# Altium project antenna_connection.PrjPcb
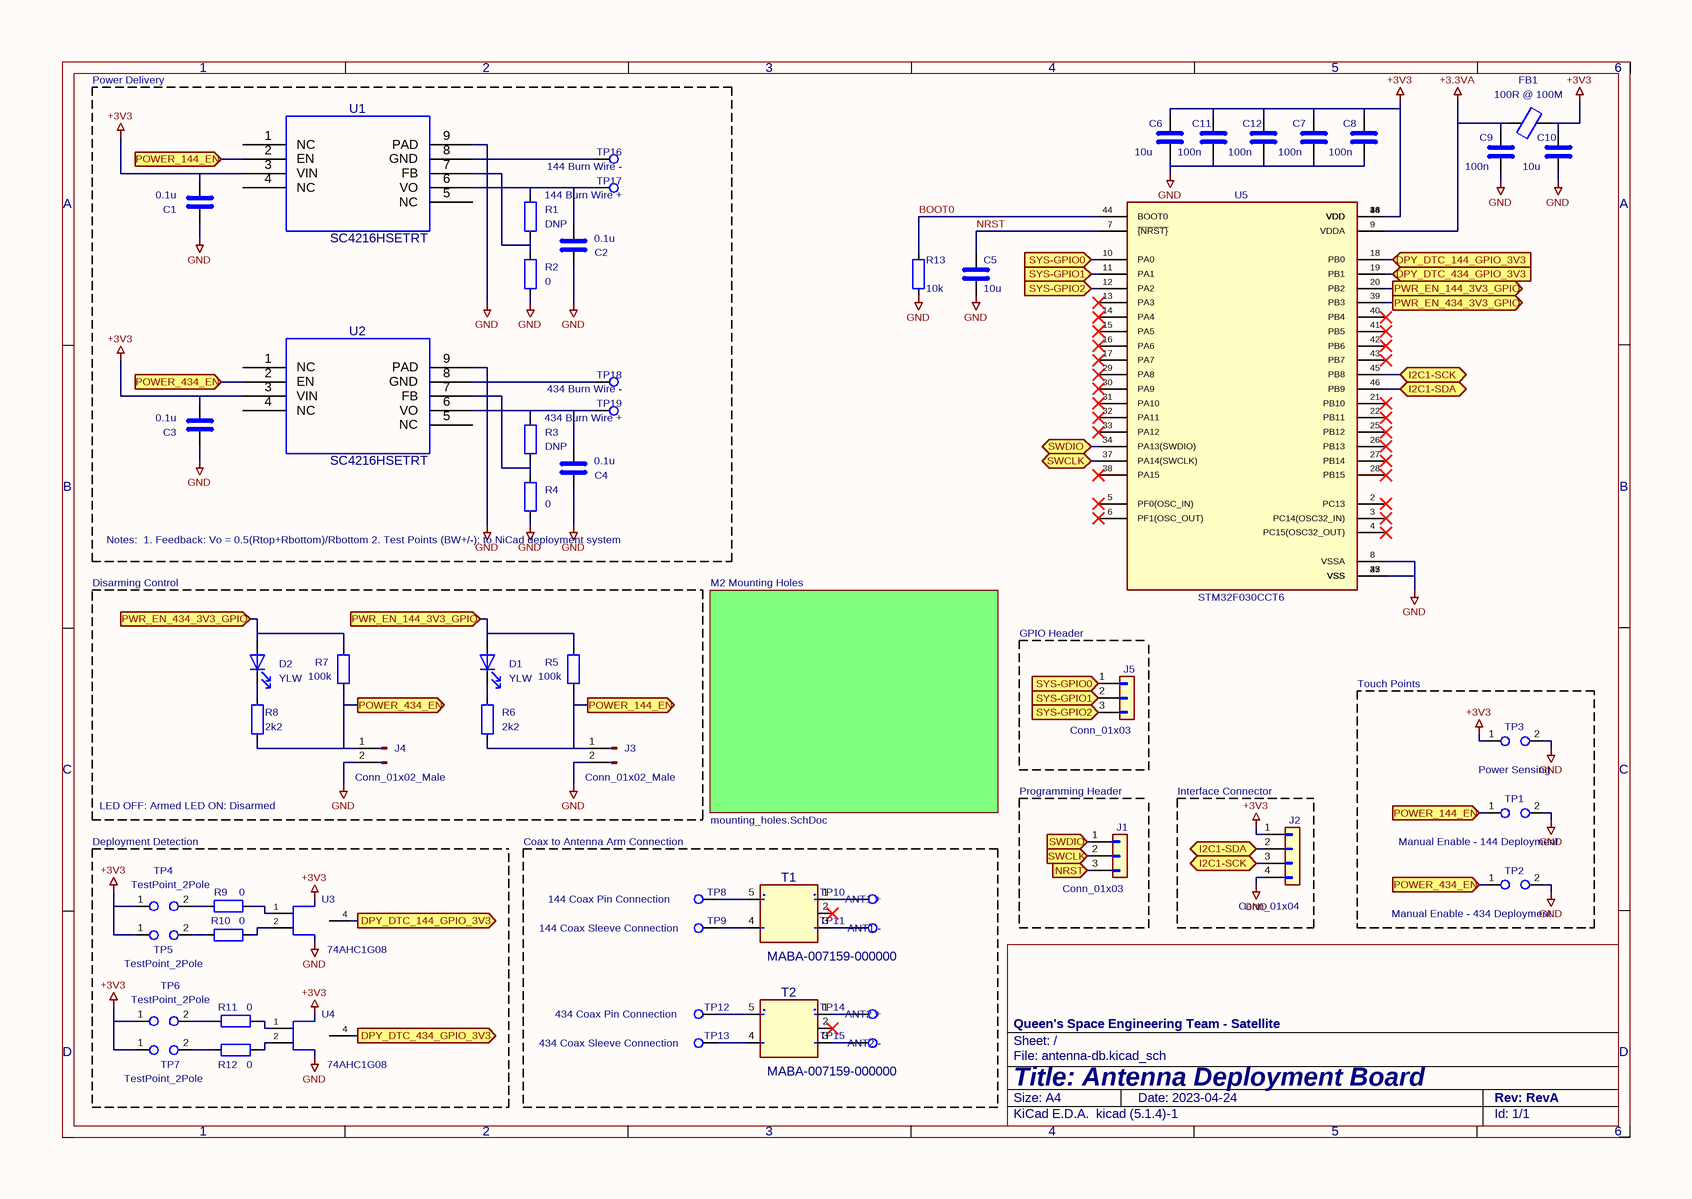
[diagram p0: antenna-db.SchDoc]
6 sheets, 99 parts. Net scope: flat (ports and power ports of the same name join across sheets).
Board files: antenna-db.PcbDoc, antenna-db(1).PcbDoc
Sheets:
  antenna_connection.SchDoc
  antenna-db.SchDoc
    M2 Mounting Holes = mounting_holes.SchDoc
  power_delivery.SchDoc
  temperature_sensor.SchDoc
  testconnectors.SchDoc

## Sheet antenna_connection.SchDoc
size 297 x 209 mm

### Notes on the sheet
- 1
- 2
- 3
- 4
- 5
- 6
- A
- B
- C
- D
- Title: Antenna Deployment Board
- File: antenna_connection.kicad_sch
- Sheet: /
- Queen's Space Engineering Team - Satellite
- KiCad E.D.A.  kicad (5.1.4)-1
- Size: A4
- Date: 2023-04-24
- Rev: RevA
- Id: 1/1

## Sheet antenna-db.SchDoc
size 297 x 209 mm

### Parts
(Parts that share a designator on the sheet are numbered #1, #2 ... from top to bottom, then left to right.)
C1#1  0.1u  [C_0603_1608Metric]
C2  0.1u  [C_0603_1608Metric]
C3#1  0.1u  [C_0603_1608Metric]
C4#1  0.1u  [C_0603_1608Metric]
C5#1  10u  [C_0603_1608Metric]
C6  10u  [C_0603_1608Metric]
C7  100n  [C_0603_1608Metric]
C8  100n  [C_0603_1608Metric]
C9  100n  [C_0603_1608Metric]
C10  10u  [C_0603_1608Metric]
C11  100n  [C_0603_1608Metric]
C12  100n  [C_0603_1608Metric]
D1  YLW  [LED_0603_1608Metric]
D2  YLW  [LED_0603_1608Metric]
FB1  100R @ 100M  [L_0603_1608Metric]
J1  Conn_01x03  [SAMTEC_TSM-103-01-L-SH]
J2  Conn_01x04  [SAMTEC_TSM-104-01-L-SH]
J3  Conn_01x02_Male  [SAMTEC_TSM-102-01-L-SH]
J4  Conn_01x02_Male  [SAMTEC_TSM-102-01-L-SH]
J5  Conn_01x03  [SAMTEC_TSM-103-01-L-SH]
R1  DNP  [R_0603_1608Metric_Pad0.98x0.95mm_HandSolder]
R2  0  [R_0603_1608Metric_Pad0.98x0.95mm_HandSolder]
R3  DNP  [R_0603_1608Metric_Pad0.98x0.95mm_HandSolder]
R4  0  [R_0603_1608Metric_Pad0.98x0.95mm_HandSolder]
R5#1  100k  [R_0603_1608Metric]
R6  2k2  [R_0603_1608Metric]
R7#1  100k  [R_0603_1608Metric]
R8#1  2k2  [R_0603_1608Metric]
R9#1  0  [R_0603_1608Metric]
R10  0  [R_0603_1608Metric]
R11  0  [R_0603_1608Metric]
R12  0  [R_0603_1608Metric]
R13  10k  [R_0603_1608Metric]
T1  MABA-007159-000000  [MABA-007159-000000]
T2  MABA-007159-000000  [MABA-007159-000000]
TP1#1  Manual Enable - 144 Deployment  [TestPoint_2Pads_Pitch2.54mm_Drill0.8mm]
TP2#1  Manual Enable - 434 Deployment  [TestPoint_2Pads_Pitch2.54mm_Drill0.8mm]
TP3#1  Power Sensing  [TestPoint_2Pads_Pitch2.54mm_Drill0.8mm]
TP4#1  TestPoint_2Pole  [TestPoint_2Pads_Pitch2.54mm_Drill0.8mm]
TP5#1  TestPoint_2Pole  [TestPoint_2Pads_Pitch2.54mm_Drill0.8mm]
TP6  TestPoint_2Pole  [TestPoint_2Pads_Pitch2.54mm_Drill0.8mm]
TP7  TestPoint_2Pole  [TestPoint_2Pads_Pitch2.54mm_Drill0.8mm]
TP8  144 Coax Pin Connection  [TestPoint_THTPad_2.0x2.0mm_Drill1.0mm]
TP9#1  144 Coax Sleeve Connection  [TestPoint_THTPad_2.0x2.0mm_Drill1.0mm]
TP10  ANT1 +  [TestPoint_THTPad_4.0x4.0mm_Drill2.0mm]
TP11  ANT1 -  [TestPoint_THTPad_4.0x4.0mm_Drill2.0mm]
TP12  434 Coax Pin Connection  [TestPoint_THTPad_2.0x2.0mm_Drill1.0mm]
TP13  434 Coax Sleeve Connection  [TestPoint_THTPad_2.0x2.0mm_Drill1.0mm]
TP14  ANT2 +  [TestPoint_THTPad_4.0x4.0mm_Drill2.0mm]
TP15  ANT2 -  [TestPoint_THTPad_4.0x4.0mm_Drill2.0mm]
TP16  144 Burn Wire -  [TestPoint_THTPad_2.0x2.0mm_Drill1.0mm]
TP17  144 Burn Wire +  [TestPoint_THTPad_2.0x2.0mm_Drill1.0mm]
TP18  434 Burn Wire -  [TestPoint_THTPad_2.0x2.0mm_Drill1.0mm]
TP19  434 Burn Wire +  [TestPoint_THTPad_2.0x2.0mm_Drill1.0mm]
U1  SC4216HSETRT  [SOIC-8-1EP_3.9x4.9mm_P1.27mm_EP2.29x3mm]
U2  SC4216HSETRT  [SOIC-8-1EP_3.9x4.9mm_P1.27mm_EP2.29x3mm]
U3  74AHC1G08  [SOT-353_SC-70-5]
U4#1  74AHC1G08  [SOT-353_SC-70-5]
U5#1  STM32F030CCT6  [QFP50P900X900X160-48N]

### Blocks framed on the sheet
Power Delivery: C1#1 C2 C3#1 C4#1 R1-R4 TP16-TP19 U1 U2
GPIO Header: J5
Touch Points: TP1#1 TP2#1 TP3#1
Programming Header: J1
Interface Connector: J2
Deployment Detection: R9#1 R10-R12 TP4#1 TP5#1 TP6 TP7 U3 U4#1
Coax to Antenna Arm Connection: T1 T2 TP8 TP9#1 TP10-TP15

### Sub-sheets
M2 Mounting Holes = mounting_holes.SchDoc: no entries

### Ports
DPY_DTC_144_GPIO_3V3 (in), DPY_DTC_144_GPIO_3V3 (out), DPY_DTC_434_GPIO_3V3 (in), DPY_DTC_434_GPIO_3V3 (out), I2C1-SCK (bidir), I2C1-SDA (bidir), NRST (in), POWER_144_EN (in), POWER_144_EN (out), POWER_434_EN (in), POWER_434_EN (out), PWR_EN_144_3V3_GPIO (in), PWR_EN_144_3V3_GPIO (out), PWR_EN_434_3V3_GPIO (in), PWR_EN_434_3V3_GPIO (out), SWCLK (bidir), SWCLK (in), SWDIO (bidir), SWDIO (in), SYS-GPIO0 (in), SYS-GPIO1 (in), SYS-GPIO2 (in)

### Nets
+3.3VA: C9.1 FB1.1 U5#1.9(VDDA)
+3V3: C1#1.2 C3#1.2 C6.1 C7.1 C8.1 C10.1 C11.1 C12.1 FB1.2 J2.1(Pin_1) TP3#1.1 TP4#1.1 TP5#1.1 TP6.1 TP7.1 U1.3(VIN) U2.3(VIN) U5#1.1(VDD) U5#1.24(VDD) U5#1.36(VDD) U5#1.48(VDD)
GND: C1#1.1 C2.1 C3#1.1 C4#1.1 C5#1.2 C6.2 C7.2 C8.2 C9.2 C10.2 C11.2 C12.2 J2.4(Pin_4) J3.2(Pin_2) J4.2(Pin_2) R2.2 R4.2 R13.2 TP1#1.2 TP2#1.2 TP3#1.2 TP16.1 TP18.1 U1.8(GND) U1.9(PAD) U2.8(GND) U2.9(PAD) U5#1.8(VSSA) U5#1.23(VSS) U5#1.35(VSS) U5#1.47(VSS)
BOOT0: R13.1 U5#1.44(BOOT0)
DPY_DTC_144_GPIO_3V3: U3.4 U5#1.18(PB0) ; port DPY_DTC_144_GPIO_3V3
DPY_DTC_434_GPIO_3V3: U4#1.4 U5#1.19(PB1) ; port DPY_DTC_434_GPIO_3V3
I2C1-SCK: J2.3(Pin_3) U5#1.45(PB8) ; port I2C1-SCK
I2C1-SDA: J2.2(Pin_2) U5#1.46(PB9) ; port I2C1-SDA
NRST: J1.3(Pin_3) ; port NRST
NRST: C5#1.1 U5#1.7(~{{NRST}})  [a separate net that carries the same name]
POWER_144_EN: J3.1(Pin_1) R5#1.2 R6.2 TP1#1.1 U1.2(EN) ; port POWER_144_EN
POWER_434_EN: J4.1(Pin_1) R7#1.2 R8#1.2 TP2#1.1 U2.2(EN) ; port POWER_434_EN
PWR_EN_144_3V3_GPIO: D1.2(A) R5#1.1 U5#1.20(PB2) ; port PWR_EN_144_3V3_GPIO
PWR_EN_434_3V3_GPIO: D2.2(A) R7#1.1 U5#1.39(PB3) ; port PWR_EN_434_3V3_GPIO
SWCLK: J1.2(Pin_2) U5#1.37(PA14(SWCLK)) ; port SWCLK
SWDIO: J1.1(Pin_1) U5#1.34(PA13(SWDIO)) ; port SWDIO
SYS-GPIO0: J5.1(Pin_1) U5#1.10(PA0) ; port SYS-GPIO0
SYS-GPIO1: J5.2(Pin_2) U5#1.11(PA1) ; port SYS-GPIO1
SYS-GPIO2: J5.3(Pin_3) U5#1.12(PA2) ; port SYS-GPIO2
NetC2_2: C2.2 R1.1 TP17.1 U1.6(VO)
NetC4#1_2: C4#1.2 R3.1 TP19.1 U2.6(VO)
NetD1_1: D1.1(K) R6.1
NetD2_1: D2.1(K) R8#1.1
NetR1_2: R1.2 R2.1 U1.7(FB)
NetR3_2: R3.2 R4.1 U2.7(FB)
NetR9#1_1: R9#1.1 TP4#1.2
NetR9#1_2: R9#1.2 U3.1
NetR10_1: R10.1 TP5#1.2
NetR10_2: R10.2 U3.2
NetR11_1: R11.1 TP6.2
NetR11_2: R11.2 U4#1.1
NetR12_1: R12.1 TP7.2
NetR12_2: R12.2 U4#1.2
NetT1_1: T1.1 TP10.1
NetT1_3: T1.3 TP11.1
NetT1_4: T1.4 TP9#1.1
NetT1_5: T1.5 TP8.1
NetT2_1: T2.1 TP14.1
NetT2_3: T2.3 TP15.1
NetT2_4: T2.4 TP13.1
NetT2_5: T2.5 TP12.1

Not connected (* = marked no-connect by the designer): T1 2*; T2 2*; U1 1(NC) 4(NC) 5(NC); U2 1(NC) 4(NC) 5(NC); U3 3(GND) 5(VCC); U4#1 3(GND) 5(VCC); U5#1 2(PC13)* 3(PC14(OSC32_IN))* 4(PC15(OSC32_OUT))* 5(PF0(OSC_IN))* 6(PF1(OSC_OUT))* 13(PA3)* 14(PA4)* 15(PA5)* 16(PA6)* 17(PA7)* 21(PB10)* 22(PB11)* 25(PB12)* 26(PB13)* 27(PB14)* 28(PB15)* 29(PA8)* 30(PA9)* 31(PA10)* 32(PA11)* 33(PA12)* 38(PA15)* 40(PB4)* 41(PB5)* 42(PB6)* 43(PB7)*

### Notes on the sheet
- (near R4) Notes:
  1. Feedback: Vo = 0.5(Rtop+Rbottom)/Rbottom
  2. Test Points (BW+/-): to NiCad deployment system
- Disarming Control
- LED OFF: Armed
  LED ON: Disarmed
- 1
- 2
- 3
- 4
- 5
- 6
- A
- B
- C
- D
- Title: Antenna Deployment Board
- File: antenna-db.kicad_sch
- Sheet: /
- Queen's Space Engineering Team - Satellite
- KiCad E.D.A.  kicad (5.1.4)-1
- Size: A4
- Date: 2023-04-24
- Rev: RevA
- Id: 1/1

### Library data of the parts
C1#1 C2 C3#1 C4#1 C5#1 C6-C12 = C: Footprint: Capacitor_SMD:C_0603_1608Metric
  C1#1 C2 C3#1 C4#1: Value: 0.1u
  C5#1 C6 C10: Value: 10u
  C7-C9 C11 C12: Value: 100n
D1 D2 = LED: Value: YLW; Footprint: LED_SMD:LED_0603_1608Metric
FB1 = FerriteBead: Value: 100R @ 100M; Footprint: Inductor_SMD:L_0603_1608Metric
R1-R4 R5#1 R6 R7#1 R8#1 R9#1 R10-R13 = R
  R1 R3: Value: DNP; Footprint: Resistor_SMD:R_0603_1608Metric_Pad0.98x0.95mm_HandSolder
  R2 R4: Value: 0; Footprint: Resistor_SMD:R_0603_1608Metric_Pad0.98x0.95mm_HandSolder
  R5#1 R7#1: Value: 100k; Footprint: Resistor_SMD:R_0603_1608Metric
  R6 R8#1: Value: 2k2; Footprint: Resistor_SMD:R_0603_1608Metric
  R9#1 R10-R12: Value: 0; Footprint: Resistor_SMD:R_0603_1608Metric
  R13: Value: 10k; Footprint: Resistor_SMD:R_0603_1608Metric
T1 T2 = MABA-007159-000000: Manufacturer: M/A-Com Technology Solutions; DK_Detail_Page: /product-detail/en/m-a-com-technology-solutions/MABA-007159-000000/1465-1302-1-ND/4429999; Description: BALUN 4.5MHZ-3GHZ 1:1 6SMD FLAT; Digi-Key_PN: 1465-1302-1-ND; MPN: MABA-007159-000000; Category: RF/IF and RFID; Family: Balun; DK_Datasheet_Link: http://cdn.macom.com/datasheets/MABA-007159-000000.pdf; Status: Active; Value: MABA-007159-000000; Footprint: qset-footprints:MABA-007159-000000
TP1#1 TP2#1 TP3#1 = TestPoint_2Pole: Footprint: TestPoint:TestPoint_2Pads_Pitch2.54mm_Drill0.8mm
  TP1#1: Value: Manual Enable - 144 Deployment
  TP2#1: Value: Manual Enable - 434 Deployment
  TP3#1: Value: Power Sensing
TP8 TP9#1 TP10-TP19 = TestPoint
  TP8: Value: 144 Coax Pin Connection; Footprint: TestPoint:TestPoint_THTPad_2.0x2.0mm_Drill1.0mm
  TP9#1: Value: 144 Coax Sleeve Connection; Footprint: TestPoint:TestPoint_THTPad_2.0x2.0mm_Drill1.0mm
  TP10: Value: ANT1 +; Footprint: TestPoint:TestPoint_THTPad_4.0x4.0mm_Drill2.0mm
  TP11: Value: ANT1 -; Footprint: TestPoint:TestPoint_THTPad_4.0x4.0mm_Drill2.0mm
  TP12: Value: 434 Coax Pin Connection; Footprint: TestPoint:TestPoint_THTPad_2.0x2.0mm_Drill1.0mm
  TP13: Value: 434 Coax Sleeve Connection; Footprint: TestPoint:TestPoint_THTPad_2.0x2.0mm_Drill1.0mm
  TP14: Value: ANT2 +; Footprint: TestPoint:TestPoint_THTPad_4.0x4.0mm_Drill2.0mm
  TP15: Value: ANT2 -; Footprint: TestPoint:TestPoint_THTPad_4.0x4.0mm_Drill2.0mm
  TP16: Value: 144 Burn Wire -; Footprint: TestPoint:TestPoint_THTPad_2.0x2.0mm_Drill1.0mm
  TP17: Value: 144 Burn Wire +; Footprint: TestPoint:TestPoint_THTPad_2.0x2.0mm_Drill1.0mm
  TP18: Value: 434 Burn Wire -; Footprint: TestPoint:TestPoint_THTPad_2.0x2.0mm_Drill1.0mm
  TP19: Value: 434 Burn Wire +; Footprint: TestPoint:TestPoint_THTPad_2.0x2.0mm_Drill1.0mm
U5#1 = STM32F030CCT6: MANUFACTURER: STMicroelectronics; Value: STM32F030CCT6
J1 J5 = Conn_01x03: Value: Conn_01x03; Footprint: qset-footprints:SAMTEC_TSM-103-01-L-SH
J2 = Conn_01x04: Value: Conn_01x04; Footprint: qset-footprints:SAMTEC_TSM-104-01-L-SH
J3 J4 = Conn_01x02_Male: Value: Conn_01x02_Male; Footprint: qset-footprints:SAMTEC_TSM-102-01-L-SH
TP4#1 TP5#1 TP6 TP7 = TestPoint_2Pole: Value: TestPoint_2Pole; Footprint: TestPoint:TestPoint_2Pads_Pitch2.54mm_Drill0.8mm
U1 U2 = SC4216HSETRT: Value: SC4216HSETRT; Footprint: Package_SO:SOIC-8-1EP_3.9x4.9mm_P1.27mm_EP2.29x3mm
U3 U4#1 = 74AHC1G08: Value: 74AHC1G08; Footprint: Package_TO_SOT_SMD:SOT-353_SC-70-5

## Sheet mounting_holes.SchDoc
size 297 x 209 mm
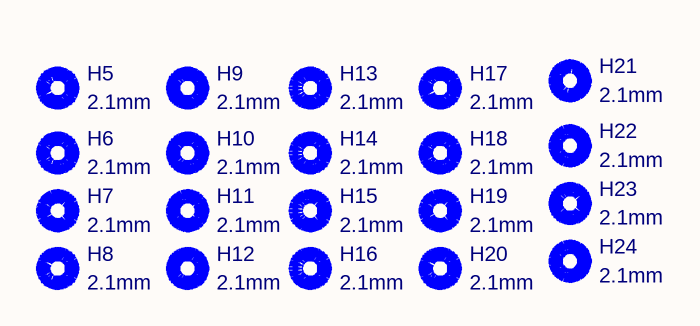
[diagram p1: mounting_holes.SchDoc]

### Parts
H5  2.1mm  [MountingHole_2.2mm_M2_Pad_TopBottom]
H6  2.1mm  [MountingHole_2.2mm_M2_Pad_TopBottom]
H7  2.1mm  [MountingHole_2.2mm_M2_Pad_TopBottom]
H8  2.1mm  [MountingHole_2.2mm_M2_Pad_TopBottom]
H9  2.1mm  [MountingHole_2.2mm_M2_Pad_TopBottom]
H10  2.1mm  [MountingHole_2.2mm_M2_Pad_TopBottom]
H11  2.1mm  [MountingHole_2.2mm_M2_Pad_TopBottom]
H12  2.1mm  [MountingHole_2.2mm_M2_Pad_TopBottom]
H13  2.1mm  [MountingHole_2.2mm_M2_Pad_TopBottom]
H14  2.1mm  [MountingHole_2.2mm_M2_Pad_TopBottom]
H15  2.1mm  [MountingHole_2.2mm_M2_Pad_TopBottom]
H16  2.1mm  [MountingHole_2.2mm_M2_Pad_TopBottom]
H17  2.1mm  [MountingHole_2.2mm_M2_Pad_TopBottom]
H18  2.1mm  [MountingHole_2.2mm_M2_Pad_TopBottom]
H19  2.1mm  [MountingHole_2.2mm_M2_Pad_TopBottom]
H20  2.1mm  [MountingHole_2.2mm_M2_Pad_TopBottom]
H21  2.1mm  [MountingHole_2.2mm_M2_Pad_TopBottom]
H22  2.1mm  [MountingHole_2.2mm_M2_Pad_TopBottom]
H23  2.1mm  [MountingHole_2.2mm_M2_Pad_TopBottom]
H24  2.1mm  [MountingHole_2.2mm_M2_Pad_TopBottom]

### Notes on the sheet
- 1
- 2
- 3
- 4
- 5
- 6
- A
- B
- C
- D
- Title: Antenna Deployment Board
- File: mounting_holes.kicad_sch
- Sheet: /
- Queen's Space Engineering Team - Satellite
- KiCad E.D.A.  kicad (5.1.4)-1
- Size: A4
- Date: 2023-04-24
- Rev: RevA
- Id: 1/1

### Library data of the parts
H5-H24 = MountingHole: Value: 2.1mm; Footprint: MountingHole:MountingHole_2.2mm_M2_Pad_TopBottom

## Sheet power_delivery.SchDoc
size 297 x 209 mm
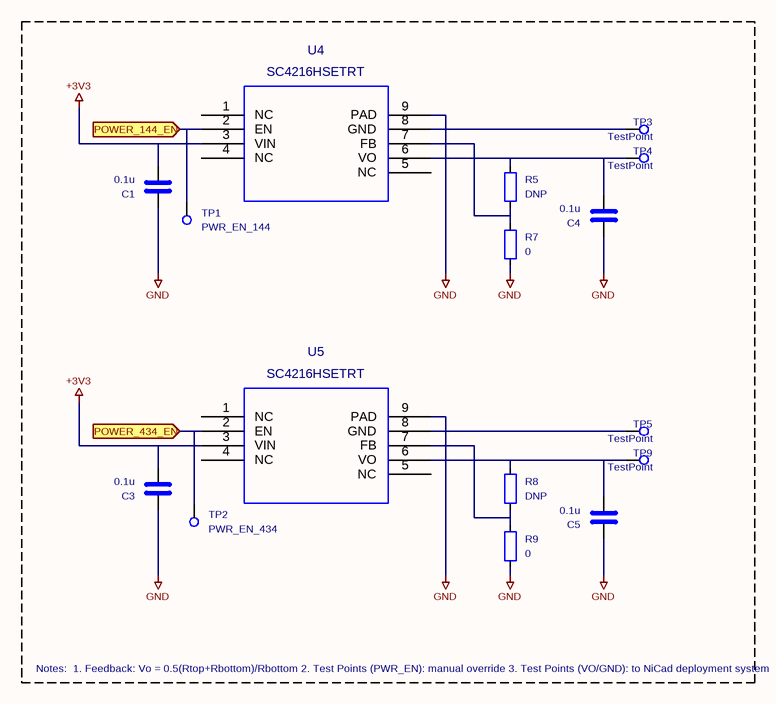
[diagram p2: power_delivery.SchDoc]

### Parts
(Parts that share a designator on the sheet are numbered #1, #2 ... from top to bottom, then left to right.)
C1#2  0.1u  [C_0603_1608Metric]
C3#2  0.1u  [C_0603_1608Metric]
C4#2  0.1u  [C_0603_1608Metric]
C5#2  0.1u  [C_0603_1608Metric]
R5#2  DNP  [R_0603_1608Metric_Pad0.98x0.95mm_HandSolder]
R7#2  0  [R_0603_1608Metric_Pad0.98x0.95mm_HandSolder]
R8#2  DNP  [R_0603_1608Metric_Pad0.98x0.95mm_HandSolder]
R9#2  0  [R_0603_1608Metric_Pad0.98x0.95mm_HandSolder]
TP1#2  PWR_EN_144  [TestPoint_THTPad_4.0x4.0mm_Drill2.0mm]
TP2#2  PWR_EN_434  [TestPoint_THTPad_4.0x4.0mm_Drill2.0mm]
TP3#2  TestPoint  [TestPoint_THTPad_4.0x4.0mm_Drill2.0mm]
TP4#2  TestPoint  [TestPoint_THTPad_4.0x4.0mm_Drill2.0mm]
TP5#2  TestPoint  [TestPoint_THTPad_4.0x4.0mm_Drill2.0mm]
TP9#2  TestPoint  [TestPoint_THTPad_4.0x4.0mm_Drill2.0mm]
U4#2  SC4216HSETRT  [SOIC-8-1EP_3.9x4.9mm_P1.27mm_EP2.29x3mm]
U5#2  SC4216HSETRT  [SOIC-8-1EP_3.9x4.9mm_P1.27mm_EP2.29x3mm]

### Ports
POWER_144_EN (in), POWER_434_EN (in)

### Nets
+3V3: C1#2.2 C3#2.2 U4#2.3(VIN) U5#2.3(VIN)
GND: C1#2.1 C3#2.1 C4#2.1 C5#2.1 R7#2.2 R9#2.2 TP3#2.1 TP5#2.1 U4#2.8(GND) U4#2.9(PAD) U5#2.8(GND) U5#2.9(PAD)
POWER_144_EN: TP1#2.1 U4#2.2(EN) ; port POWER_144_EN
POWER_434_EN: TP2#2.1 U5#2.2(EN) ; port POWER_434_EN
NetC4#2_2: C4#2.2 R5#2.1 TP4#2.1 U4#2.6(VO)
NetC5#2_2: C5#2.2 R8#2.1 TP9#2.1 U5#2.6(VO)
NetR5#2_2: R5#2.2 R7#2.1 U4#2.7(FB)
NetR8#2_2: R8#2.2 R9#2.1 U5#2.7(FB)

Not connected (* = marked no-connect by the designer): U4#2 1(NC) 4(NC) 5(NC); U5#2 1(NC) 4(NC) 5(NC)

### Notes on the sheet
- Notes:
  1. Feedback: Vo = 0.5(Rtop+Rbottom)/Rbottom
  2. Test Points (PWR_EN): manual override
  3. Test Points (VO/GND): to NiCad deployment system
- 1
- 2
- 3
- 4
- 5
- 6
- A
- B
- C
- D
- Title: Antenna Deployment Board
- File: power_delivery.kicad_sch
- Sheet: /
- Queen's Space Engineering Team - Satellite
- KiCad E.D.A.  kicad (5.1.4)-1
- Size: A4
- Date: 2023-04-24
- Rev: RevA
- Id: 1/1

### Library data of the parts
C1#2 C3#2 C4#2 C5#2 = C: Value: 0.1u; Footprint: Capacitor_SMD:C_0603_1608Metric
R5#2 R7#2 R8#2 R9#2 = R: Footprint: Resistor_SMD:R_0603_1608Metric_Pad0.98x0.95mm_HandSolder
  R5#2 R8#2: Value: DNP
  R7#2 R9#2: Value: 0
TP1#2 TP2#2 = TestPoint: Footprint: TestPoint:TestPoint_THTPad_4.0x4.0mm_Drill2.0mm
  TP1#2: Value: PWR_EN_144
  TP2#2: Value: PWR_EN_434
TP3#2 TP4#2 TP5#2 TP9#2 = TestPoint: Value: TestPoint; Footprint: TestPoint:TestPoint_THTPad_4.0x4.0mm_Drill2.0mm
U4#2 U5#2 = SC4216HSETRT: Value: SC4216HSETRT; Footprint: Package_SO:SOIC-8-1EP_3.9x4.9mm_P1.27mm_EP2.29x3mm

## Sheet temperature_sensor.SchDoc
size 297 x 209 mm
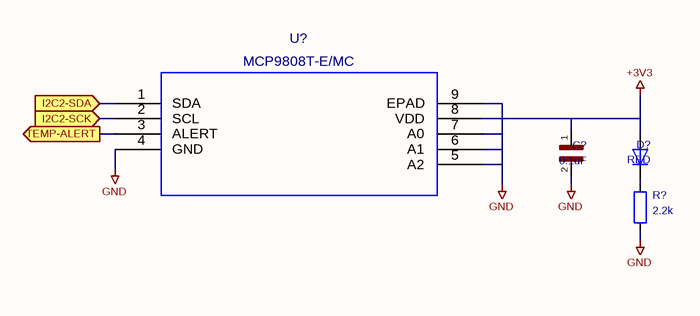
[diagram p3: temperature_sensor.SchDoc]

### Parts
C?  0.1uF  [C_0603_1608Metric]
D?  RED  [D_0603_1608Metric]
R?  2.2k  [R_0603_1608Metric]
U?  MCP9808T-E/MC  [MCP9808T-E&slash_MC]

### Ports
I2C2-SCK (in), I2C2-SDA (in), TEMP-ALERT (out)

### Nets
+3V3: C?.1 D?.1(A) U?.8(VDD)
GND: C?.2 R?.2 U?.4(GND) U?.5(A2) U?.6(A1) U?.7(A0) U?.9(EPAD)
I2C2-SCK: U?.2(SCL) ; port I2C2-SCK
I2C2-SDA: U?.1(SDA) ; port I2C2-SDA
TEMP-ALERT: U?.3(ALERT) ; port TEMP-ALERT
NetD?_2: D?.2(K) R?.1

### Notes on the sheet
- 1
- 2
- 3
- 4
- 5
- 6
- A
- B
- C
- D
- Title:
- File: temperature_sensor.kicad_sch
- Sheet: /
- KiCad E.D.A.  kicad (5.1.4)-1
- Size: A4
- Date:
- Rev:
- Id: 1/1

### Library data of the parts
C? = CL10B104KB8NNNL: Value: 0.1uF; Footprint: Capacitor_SMD:C_0603_1608Metric
D? = DIODE: Spice_Netlist_Enabled: Y; Spice_Primitive: D; Value: RED; Footprint: Diode_SMD:D_0603_1608Metric
R? = R: Value: 2.2k; Footprint: Resistor_SMD:R_0603_1608Metric
U? = MCP9808T-E{slash}MC: Value: MCP9808T-E/MC; Footprint: qset-footprints:MCP9808T-E&slash_MC

## Sheet testconnectors.SchDoc
size 297 x 209 mm

### Notes on the sheet
- 1
- 2
- 3
- 4
- 5
- 6
- A
- B
- C
- D
- Title:
- File: testconnectors.kicad_sch
- Sheet: /
- KiCad E.D.A.  kicad (5.1.4)-1
- Size: A4
- Date:
- Rev:
- Id: 1/1

## Nets that join several sheets
+3V3: antenna-db (21 pins), power_delivery (C1#2.2 C3#2.2 U4#2.3 U5#2.3), temperature_sensor (C?.1 D?.1 U?.8)
GND: antenna-db (31 pins), power_delivery (12 pins), temperature_sensor (7 pins)
POWER_144_EN: antenna-db (5 pins), power_delivery (TP1#2.1 U4#2.2)
POWER_434_EN: antenna-db (5 pins), power_delivery (TP2#2.1 U5#2.2)